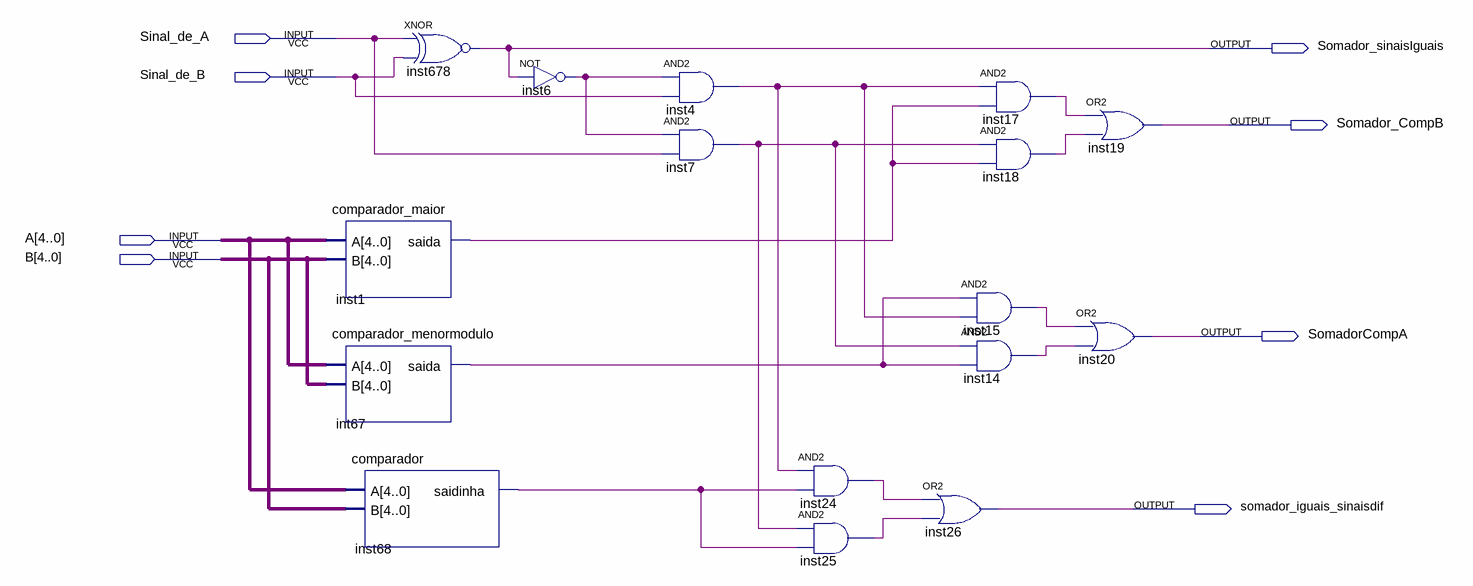
[diagram p0: schematic sheet]
// Quartus schematic sinal_do_somador.bdf as structural Verilog: 16 symbols, 8 pins
module sinal_do_somador (
  input  Sinal_de_A,
  input  Sinal_de_B,
  input  [4:0] A,
  input  [4:0] B,
  output Somador_sinaisIguais,
  output Somador_CompB,
  output SomadorCompA,
  output somador_iguais_sinaisdif
);

  wire inst1_saida, inst4_out, inst6_out, inst7_out, inst14_out, inst15_out, inst17_out, inst18_out,
       inst24_out, inst25_out, inst68_saidinha, int67_saida;

  comparador_maior inst1 (.A(A), .B(B), .saida(inst1_saida));
  comparador_menormodulo int67 (.A(A), .B(B), .saida(int67_saida));
  comparador inst68 (.A(A), .B(B), .saidinha(inst68_saidinha));
  xnor inst678 (Somador_sinaisIguais, Sinal_de_A, Sinal_de_B);
  not inst6 (inst6_out, Somador_sinaisIguais);
  and inst4 (inst4_out, inst6_out, Sinal_de_B);
  and inst7 (inst7_out, inst6_out, Sinal_de_A);
  and inst24 (inst24_out, inst4_out, inst68_saidinha);
  and inst25 (inst25_out, inst7_out, inst68_saidinha);
  and inst15 (inst15_out, int67_saida, inst4_out);
  and inst14 (inst14_out, inst7_out, int67_saida);
  or inst26 (somador_iguais_sinaisdif, inst24_out, inst25_out);
  and inst17 (inst17_out, inst4_out, inst1_saida);
  and inst18 (inst18_out, inst7_out, inst1_saida);
  or inst19 (Somador_CompB, inst17_out, inst18_out);
  or inst20 (SomadorCompA, inst15_out, inst14_out);
endmodule
